# EAGLE schematic PlugV2 (EAGLE 7.5.0)
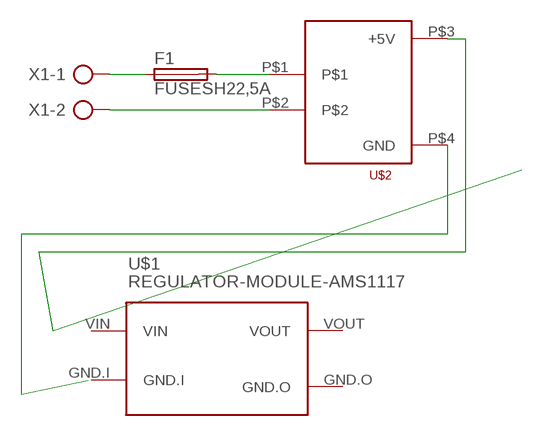
[diagram p0: schematic, sheet 1]

## Parts
F1  FUSESH22,5A  [SH22,5A]
U$1  REGULATOR-MODULE-AMS1117  [REGULATOR-MODULE-AMS1117]
U$2  HLK-PM01  [HLK-PM01]
X1  AK300/2  [AK300/2]

## Nets
N$1: F1.1 X1.1
N$2: U$2.P$2 X1.2
N$3: F1.2 U$2.P$1
N$4: U$2.P$4(GND)
N$5: U$2.P$3(+5V)
Unconnected: U$1.GND.I U$1.GND.O U$1.VIN U$1.VOUT

## Library data of the parts
F1 = fuse:FUSE: Fuse; OC_FARNELL: unknown; OC_NEWARK: unknown
U$1 = Regulator-Module-AMS1117-5to3V:REGULATOR-MODULE-AMS1117
U$2 = HLK-PM01:HLK-PM01
X1 = con-ptr500:AK300/2: CONNECTOR; OC_FARNELL: unknown; OC_NEWARK: unknown